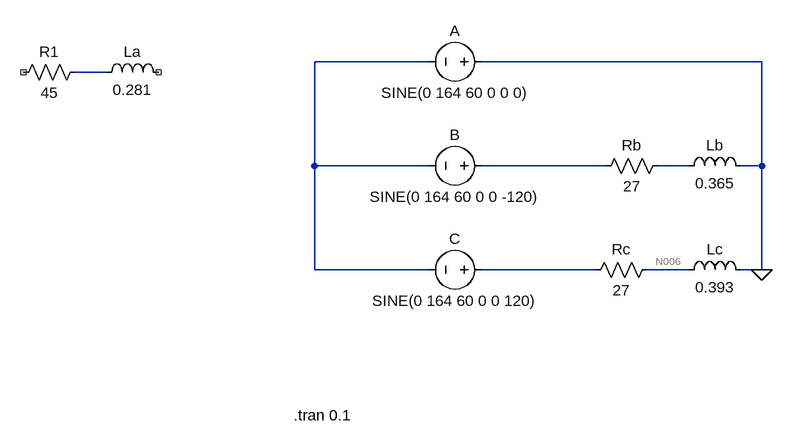
[diagram p0: schematic симметри.asc]
симметри.asc, the LTspice schematic file:
Version 4
SHEET 1 880 680
WIRE -112 80 -288 80
WIRE 400 80 -32 80
WIRE -608 96 -656 96
WIRE -288 240 -288 80
WIRE -112 240 -288 240
WIRE 160 240 -32 240
WIRE 288 240 240 240
WIRE 400 240 400 80
WIRE 400 240 368 240
WIRE -288 400 -288 240
WIRE -112 400 -288 400
WIRE 144 400 -32 400
WIRE 288 400 224 400
WIRE 400 400 400 240
WIRE 400 400 368 400
FLAG 400 400 0
SYMBOL voltage -16 80 R90
WINDOW 0 -32 56 VBottom 2
WINDOW 3 32 56 VTop 2
WINDOW 123 0 0 Left 0
WINDOW 39 0 0 Left 0
SYMATTR InstName A
SYMATTR Value SINE(0 164 60 0 0 0)
SYMBOL voltage -16 240 R90
WINDOW 0 -32 56 VBottom 2
WINDOW 3 32 56 VTop 2
SYMATTR InstName B
SYMATTR Value SINE(0 164 60 0 0 -120)
SYMBOL voltage -16 400 R90
WINDOW 0 -32 56 VBottom 2
WINDOW 3 32 56 VTop 2
SYMATTR InstName C
SYMATTR Value SINE(0 164 60 0 0 120)
SYMBOL res 144 256 R270
WINDOW 0 32 56 VTop 2
WINDOW 3 0 56 VBottom 2
SYMATTR InstName Rb
SYMATTR Value 27
SYMBOL res 128 416 R270
WINDOW 0 32 56 VTop 2
WINDOW 3 0 56 VBottom 2
SYMATTR InstName Rc
SYMATTR Value 27
SYMBOL ind -624 112 R270
WINDOW 0 32 56 VTop 2
WINDOW 3 5 56 VBottom 2
SYMATTR InstName La
SYMATTR Value 0.281
SYMBOL ind 272 256 R270
WINDOW 0 32 56 VTop 2
WINDOW 3 5 56 VBottom 2
SYMATTR InstName Lb
SYMATTR Value 0.365
SYMBOL ind 272 416 R270
WINDOW 0 32 56 VTop 2
WINDOW 3 5 56 VBottom 2
SYMATTR InstName Lc
SYMATTR Value 0.393
SYMBOL res -752 112 R270
WINDOW 0 32 56 VTop 2
WINDOW 3 0 56 VBottom 2
SYMATTR InstName R1
SYMATTR Value 45
TEXT -320 624 Left 2 !.tran 0.1

The netlist it stands for:
* симметри.asc
V§A 0 N001 SINE(0 164 60 0 0 0)
V§B N003 N001 SINE(0 164 60 0 0 -120)
V§C N005 N001 SINE(0 164 60 0 0 120)
Rb N003 N004 27
Rc N005 N006 27
La N002 NC_01 0.281
Lb N004 0 0.365
Lc N006 0 0.393
R1 NC_02 N002 45
.tran 0.1
.backanno
.end

* Results of the author's LTspice run, read from the files saved beside the schematic
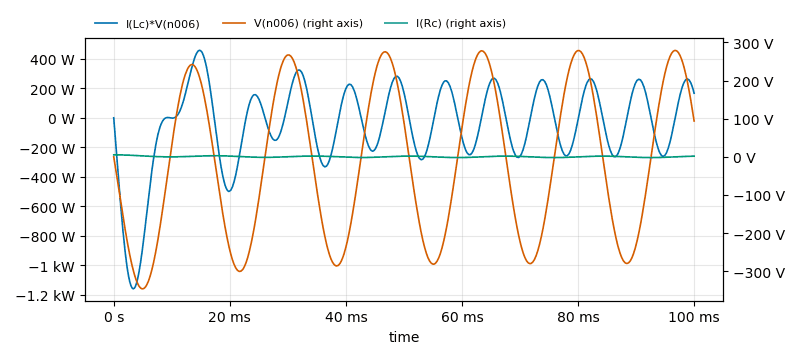
[diagram p1: Transient Analysis of симметри.asc, plotted from the saved traces]
* Transient Analysis, 1 run:
*   I(Lc)*V(n006): min -1.161 kW, max 458 W, average -48.13 W, rms 295 W, last 167.2 W
*   V(n006): min -345.9 V, max 279.2 V, average -13.67 V, rms 202.1 V, last 93.98 V
*   I(Rc): min -1.879 A, max 5.26 A, average 506.6 mA, rms 1.683 A, last 1.78 A